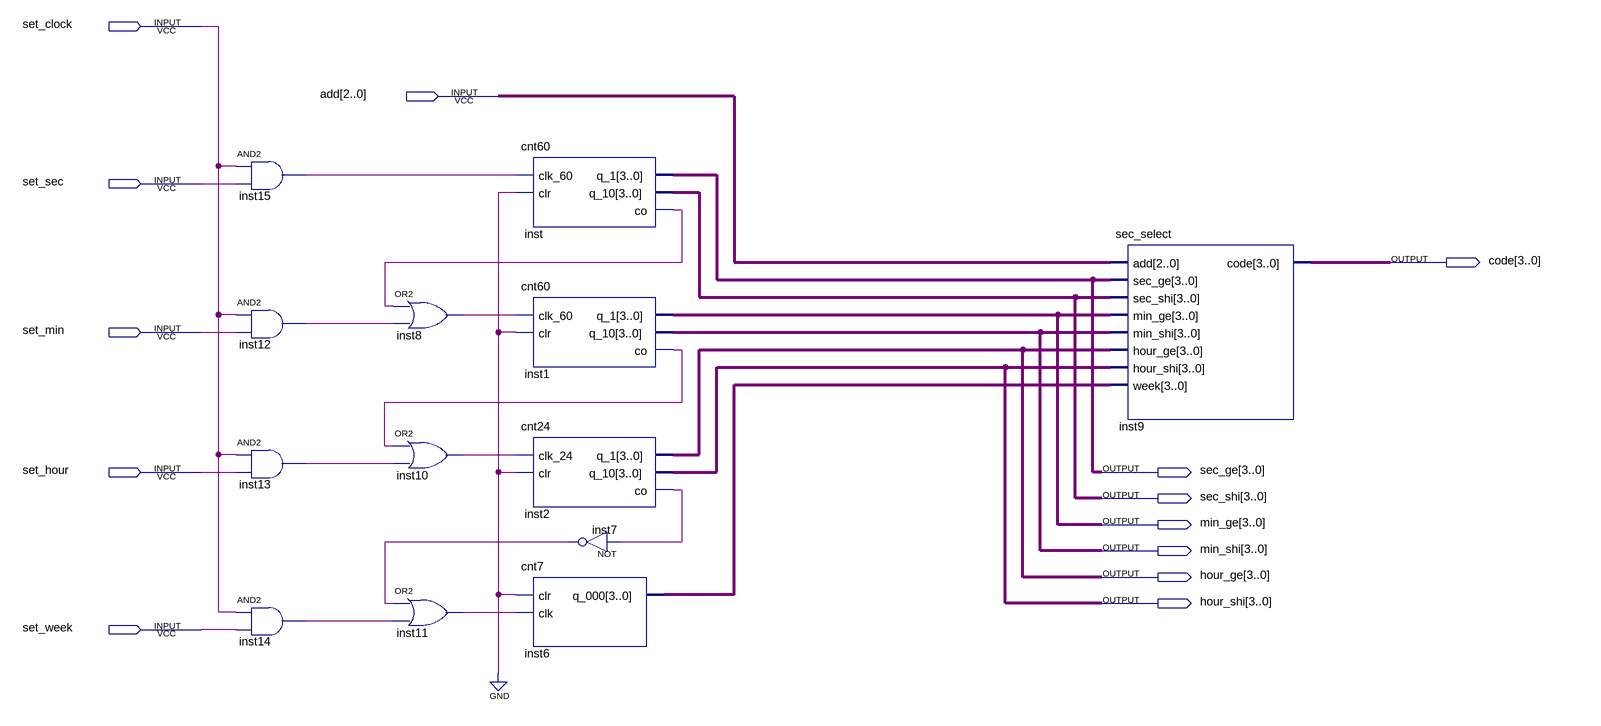
[diagram p0: schematic sheet]
// Quartus schematic clock.bdf as structural Verilog: 13 symbols, 13 pins
module clock (
  input  set_clock,
  input  [2:0] add,
  input  set_sec,
  input  set_min,
  input  set_hour,
  input  set_week,
  output [3:0] code,
  output [3:0] sec_ge,
  output [3:0] sec_shi,
  output [3:0] min_ge,
  output [3:0] min_shi,
  output [3:0] hour_ge,
  output [3:0] hour_shi
);

  wire inst1_co, inst2_co, inst7_out, inst8_out, inst10_out, inst11_out, inst12_out, inst13_out, inst14_out,
       inst15_out, inst_co;
  wire [3:0] inst6_q_000;

  and inst15 (inst15_out, set_clock, set_sec);
  and inst12 (inst12_out, set_clock, set_min);
  and inst13 (inst13_out, set_clock, set_hour);
  and inst14 (inst14_out, set_clock, set_week);
  or inst8 (inst8_out, inst_co, inst12_out);
  or inst10 (inst10_out, inst1_co, inst13_out);
  or inst11 (inst11_out, inst7_out, inst14_out);
  cnt60 inst (.clk_60(inst15_out), .clr(1'b0), .q_1(sec_ge), .q_10(sec_shi), .co(inst_co));
  cnt60 inst1 (.clk_60(inst8_out), .clr(1'b0), .q_1(min_ge), .q_10(min_shi), .co(inst1_co));
  cnt24 inst2 (.clk_24(inst10_out), .clr(1'b0), .q_1(hour_ge), .q_10(hour_shi), .co(inst2_co));
  cnt7 inst6 (.clr(1'b0), .clk(inst11_out), .q_000(inst6_q_000));
  not inst7 (inst7_out, inst2_co);
  sec_select inst9 (
    .add(add), .sec_ge(sec_ge), .sec_shi(sec_shi), .min_ge(min_ge), .min_shi(min_shi), .hour_ge(hour_ge),
    .hour_shi(hour_shi), .week(inst6_q_000), .code(code));
endmodule
